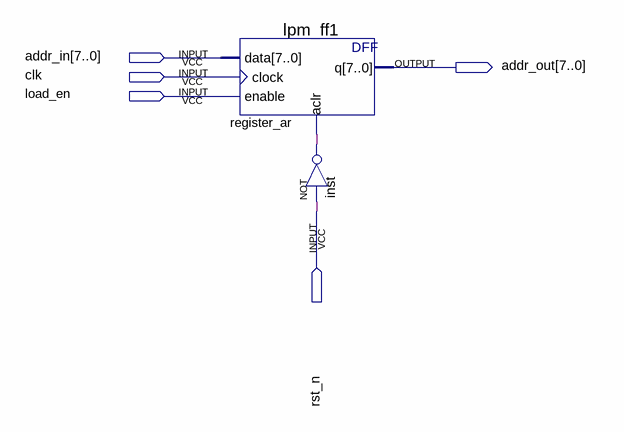
[diagram p0: schematic sheet]
// Quartus schematic ar_unit.bdf as structural Verilog: 2 symbols, 5 pins
module ar_unit (
  input  [7:0] addr_in,
  input  clk,
  input  load_en,
  input  rst_n,
  output [7:0] addr_out
);

  wire inst_out;

  lpm_ff1 register_ar (.data(addr_in), .clock(clk), .enable(load_en), .aclr(inst_out), .q(addr_out));
  not inst (inst_out, rst_n);
endmodule
